# Altium schematic sheet Main.SchDoc
size A4; SheetNumber: 1; SheetTotal: 1
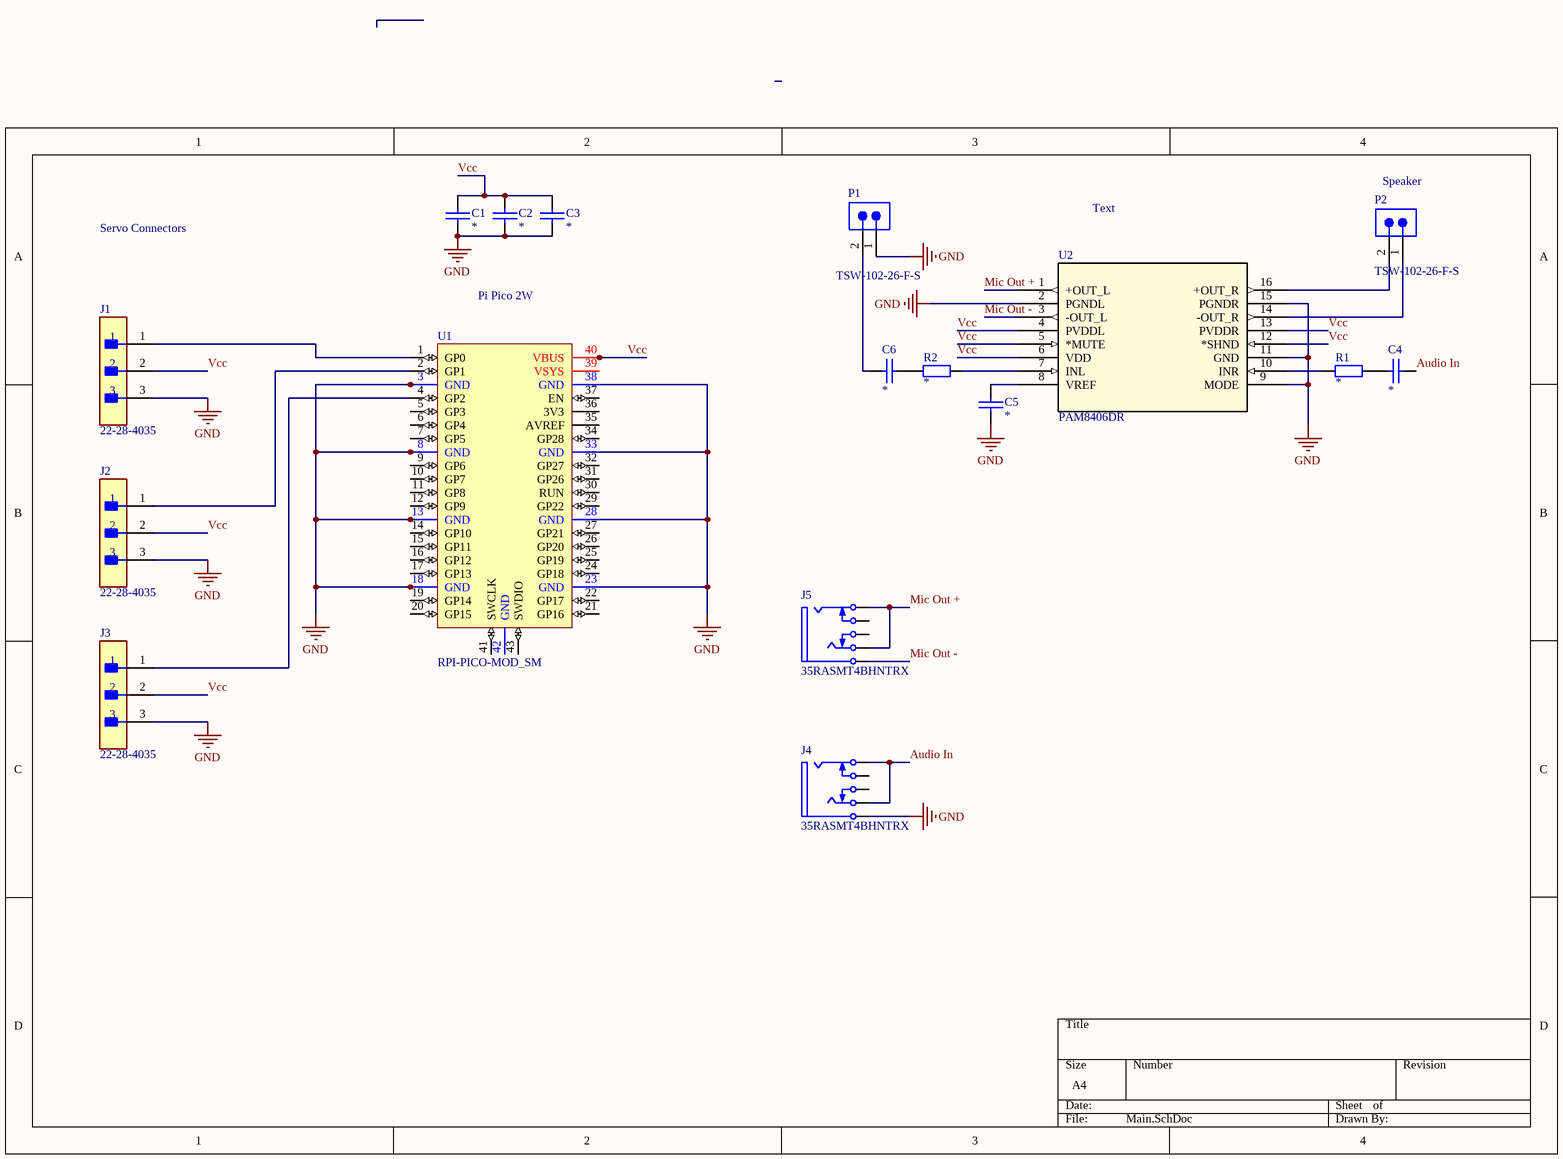
[diagram p0: Main.SchDoc]

## Parts
C1  *  [0805 CAP]
C2  *  [0805 CAP]
C3  *  [0805 CAP]
C4  *  [0805 CAP]
C5  *  [0805 CAP]
C6  *  [0805 CAP]
J1  22-28-4035  [FP-22-28-4035-MFG]
J2  22-28-4035  [FP-22-28-4035-MFG]
J3  22-28-4035  [FP-22-28-4035-MFG]
J4  35RASMT4BHNTRX  [SWIT-35RASMT4BHNTRX_V]
J5  35RASMT4BHNTRX  [SWIT-35RASMT4BHNTRX_V]
P1  TSW-102-26-F-S  [SMTC-TSW-102-26-XX-S]
P2  TSW-102-26-F-S  [SMTC-TSW-102-26-XX-S]
R1  *  [0805 RES]
R2  *  [0805 RES]
U1  RPI-PICO-MOD_SM  [RPI-PICO-MOD]
U2  PAM8406DR  [SO-16_PAM8406_DIO]

## Nets
GND: C1.2 C2.2 C3.2 C5.2 J1.3 J2.3 J3.3 J4.1 P1.1 U1.3(GND) U1.8(GND) U1.13(GND) U1.18(GND) U1.23(GND) U1.28(GND) U1.33(GND) U1.38(GND) U2.2(PGNDL) U2.9(MODE) U2.11(GND) U2.15(PGNDR)
Audio In: C4.2 J4.2 J4.3
Mic Out +: J5.2 J5.3 U2.1(+OUT_L)
Mic Out -: J5.1 U2.3(-OUT_L)
Vcc: C1.1 C2.1 C3.1 J1.2 J2.2 J3.2 U1.40(VBUS) U2.4(PVDDL) U2.5(*MUTE) U2.6(VDD) U2.12(*SHND) U2.13(PVDDR)
NetC4_1: C4.1 R1.2
NetC5_1: C5.1 U2.8(VREF)
NetC6_1: C6.1 R2.2
NetC6_2: C6.2 P1.2
NetJ1_1: J1.1 U1.1(GP0)
NetJ2_1: J2.1 U1.2(GP1)
NetJ3_1: J3.1 U1.4(GP2)
NetP2_1: P2.1 U2.14(-OUT_R)
NetP2_2: P2.2 U2.16(+OUT_R)
NetR1_1: R1.1 U2.10(INR)
NetR2_1: R2.1 U2.7(INL)

Not connected (* = marked no-connect by the designer): J4 4 5; J5 4 5; U1 5(GP3) 6(GP4) 7(GP5) 9(GP6) 10(GP7) 11(GP8) 12(GP9) 14(GP10) 15(GP11) 16(GP12) 17(GP13) 19(GP14) 20(GP15) 21(GP16) 22(GP17) 24(GP18) 25(GP19) 26(GP20) 27(GP21) 29(GP22) 30(RUN) 31(GP26) 32(GP27) 34(GP28) 35(AVREF) 36(3V3) 37(EN) 39(VSYS) 41(SWCLK) 42(GND) 43(SWDIO)

## Notes on the sheet
- Servo Connectors
- Text
- (near P2) Speaker
- Pi Pico 2W

## Library data of the parts
C1-C6 = CerCap_SMT_0805: SMT ceramic capacitor 0805 size; Value: *
J1-J3 = CMP-00257-00247547-1: 22-28-4035 BOARD-BOARD Connector HEADER, 3WAY, 1ROW; Series: KK; Pitch Spacing: 2.54mm; No. of Rows: 1;; Manufacturer Lifecycle Status: ACTIVE; NexarPartId: 247547; Plating: Tin; Max Voltage Rating (DC): 250.25kV; Voltage Rating: 250V; Current Rating: 4A; Gender: Male; Glow Wire Compliant: Non-compliant; Number of Positions: 3; Connector Type: Male Pin; Contact Resistance: 20mΩ; Color: Black; Contact Plating: Gold; Contact Material: Brass; Lead Free: Lead Free; Number of Rows: 1; Housing Material: Thermoplastic; Min Operating Temperature: 0°C; Country of Origin: US; REACH SVHC: Unknown; Lifecycle Status: Production; Mount: Through Hole; Schedule B: 8536694040; RoHS: Compliant; Termination: Through Hole; Max Operating Temperature: 75°C; Pitch: 2.54mm; Packaging: Bulk; Number of Circuits: 3; Contact Mating Length: 7.493mm; Orientation: Vertical; Housing Color: Black; Number of Contacts: 3
J4 J5 = CMP-1772-00001-1: Female 3.5 mm Phone Jack, 5 Position, Height 5 mm, RoHS, Tape and Reel; Current Rating: 50 mA; Voltage Rating (DC): 12 V; ComponentLink1URL: http://www.switchcraft.com/; ComponentLink2Description: Datasheet; ComponentLink2URL: http://www.switchcraft.com/Drawings/35rasmt4bhntrx_cd.pdf; PackageDescription: Female 3.5 mm Phone Jack, 5 Position, Height 5 mm; PackageReference: 35RASMT4BHNTRX; Mount: Through Hole; DatasheetVersion: Rev. C, 07/2014; Contact Material: Silver; ComponentLink1Description: Manufacturer URL; Packaging: Tape and Reel; RoHSCompliant: true; Contact Plating: Silver; Package Quantity: 3000
P1 P2 = CMP-1024-00329-1: 0.025" SQ Post Header, Through-hole, Vertical, -55 to 125 degC, 2.54 mm Pitch, 2-Pin, Male, RoHS; Manufacturer: Samtec; Pitch: 2.54 mm; PackageVersion: DM, 8/1988; ComponentLink2Description: Datasheet; PackageReference: TSW-102-26-XX-S; ComponentLink3URL: http://www.samtec.com/documents/webfiles/cpdf/TSW-XXX-XX-XXX-X-XX-XXX-MKT.pdf; ComponentLink2URL: http://www.samtec.com/documents/webfiles/pdf/TSW_TH.PDF; ComponentLink1Description: Manufacturer URL; DatasheetVersion: F-214; RoHS: True; ComponentLink3Description: Package Specification; PartNumber: TSW-102-26-F-S; Temperature Range: -55 to 125 degC; Orientation: Vertical; ComponentLink1URL: http://www.samtec.com; PackageDescription: .025[0.64] SQ. Post Terminal Strip Assembly; Mounting Technology: Through-hole
R1 R2 = Res_SMT_0805: 0805 resistor; Published: 8-Jun-2000; LatestRevisionDate: 17-Jul-2002; LatestRevisionNote: Re-released for DXP Platform.; PackageReference: AXIAL-0.4; Publisher: Altium Limited; Value: *; ComponentLink1Description: https://nz.mouser.com/datasheet/2/315/AOA0000C304-1149620.pdf
U1 = RPI-PICO-MOD_SM: RASPBERRY PI PICO RP2040 BOARD NO TEST PADS; Manufacturer: Raspberry Pi Foundation; Manufacturer Part No: SC0915; Mounting Technology: SMT; Supplier: DigiKey; Supplier Part No: 2648-SC0915CT-ND; Supplier Link: https://www.digikey.com/en/products/detail/raspberry-pi/SC0915/13684020
U2 = PAM8406DR: Description; Manufacturer_Name: Diodes Inc; Copyright: Copyright (C) 2025 Ultra Librarian. All rights reserved.; Manufacturer_Part_Number: PAM8406DR; RefDes: RefDes; Type: Type